# Altium schematic sheet FP_connectors.SchDoc: =ProjectName
size 420 x 297 mm; Author: SBH; CompanyName: WUT; DrawnBy: SBH; Organization: ISE-WUT; Address1: Warsaw Univeristy of Technology; Address2: Nowowiejska 15/19; Revision: -; SheetNumber: -; SheetTotal: -; EDA_Number: ARTIQ; Projet: ADC/DAC MEZZANINE; ModifiedBy: -; CreateDate: XX/XX/XXXX; CheckedDate: -; Title2: FP_connectors.SchDoc; DivGrp: ISE; Designer: SBH; ModifiedDate: -; ProjectName: ADC/DAC MEZZANINE
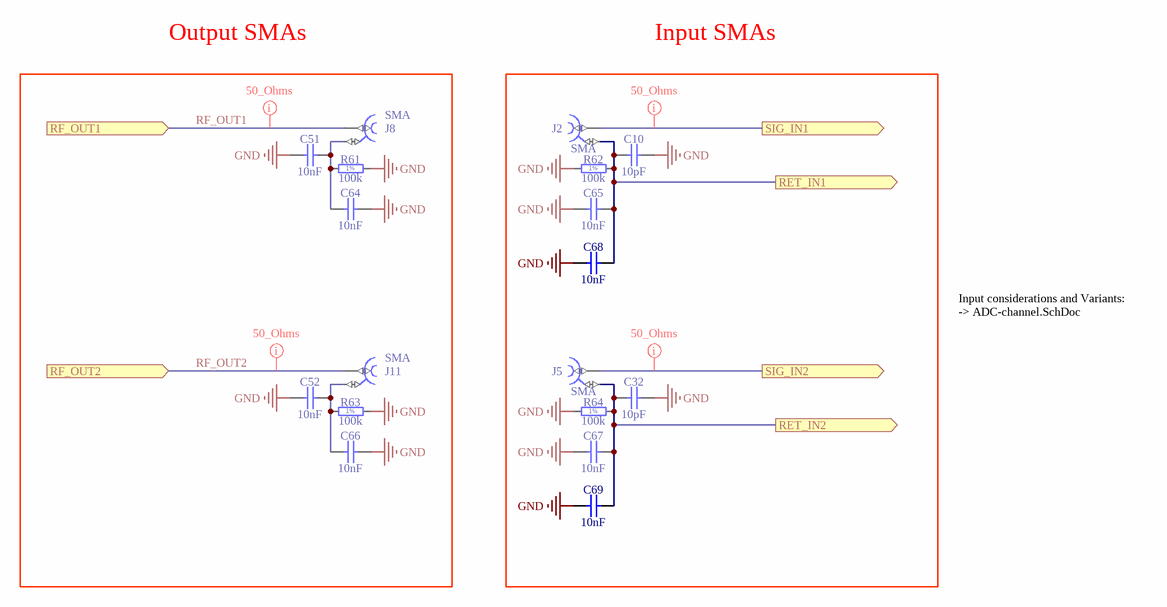
[diagram p0: FP_connectors.SchDoc]

## Parts
C10  10pF  [CAPC1005X55N]
C32  10pF  [CAPC1005X55N]
C51  10nF  [CAPC1005X55N]
C52  10nF  [CAPC1005X55N]
C64  10nF  [CAPC1005X55N]
C65  10nF  [CAPC1005X55N]
C66  10nF  [CAPC1005X55N]
C67  10nF  [CAPC1005X55N]
C68  10nF  [CAPC1005X55N]
C69  10nF  [CAPC1005X55N]
J2  SMA  [Telegartner_J01151A0921]
J5  SMA  [Telegartner_J01151A0921]
J8  SMA  [TELEGARTNER_J01151A0451]
J11  SMA  [TELEGARTNER_J01151A0451]
R61  100k  [RESC1005X40N]
R62  100k  [RESC1005X40N]
R63  100k  [RESC1005X40N]
R64  100k  [RESC1005X40N]

## Ports
RET_IN1 (out), RET_IN2 (out), RF_OUT1 (in), RF_OUT2 (in), SIG_IN1 (out), SIG_IN2 (out)

## Nets
GND: C10.2 C32.2 C51.1 C52.1 C64.2 C65.1 C66.2 C67.1 C68.1 C69.1 R61.1 R62.1 R63.1 R64.1
RET_IN1: C10.1 C65.2 C68.2 J2.2 R62.2 ; port RET_IN1
RET_IN2: C32.1 C67.2 C69.2 J5.2 R64.2 ; port RET_IN2
RF_OUT1: J8.1 ; port RF_OUT1
RF_OUT2: J11.1 ; port RF_OUT2
SIG_IN1: J2.1 ; port SIG_IN1
SIG_IN2: J5.1 ; port SIG_IN2
NetC51_2: C51.2 C64.1 J8.2 R61.2
NetC52_2: C52.2 C66.1 J11.2 R63.2

## Layout directives
net class 50_Ohms: RF_OUT1, RF_OUT2, SIG_IN1, SIG_IN2

## Notes on the sheet
- Output SMAs
- Input SMAs
- Input considerations and Variants:
  -> ADC-channel.SchDoc
- Project/Equipment
- Document
- Designer
- Drawn by
- Check.by
- File
- Last Mod.
- Print Date
- Sheet
- Size
- A3
- of
- Rev
- (in symbol R0402_100K_1%_0.0625W_100PPM) 1%

## Library data of the parts
C10 C32 = CC0402_10PF_50V_5%_C0G: Non-polarised capacitor; Part Description: SMD Multilayer Chip Ceramic Capacitor; Manufacturer: GENERIC; Manufacturer1 Part Number: C0402C100J5GACTU; Voltage: 50V; TC: C0G/NP0; Tolerance: ±5%; Part Number: CC0402_10PF_50V_5%_C0G; Component Kind: Standard; Component Type: Standard; Pin Count: 2; Value: 10pF; Status: Preferred; Manufacturer Part Number: CC0402_10PF_50V_5%_C0G; Case: 0402; Mounted: Yes; Socket: No; SMD: Yes; Sense: No; Manufacturer1 Example: KEMET; Manufacturer1 ComponentHeight: 0.55mm; HelpURL: \\cern.ch\dfs\Applications\Altium\Datasheets\CC0805_C0G_KEMET_(Commercial Grade).pdf; Author: CERN DEM JLC; CreateDate: 2007-12-03; LatestRevisionDate: 2015-04-22
C51 C52 C64-C69 = CC0402_10NF_16V_10%_X7R: Non-polarised capacitor; Part Description: SMD Multilayer Chip Ceramic Capacitor; Manufacturer: GENERIC; Manufacturer1 Part Number: 223878715636; Voltage: 16V; TC: X7R; Tolerance: ±10%; Part Number: CC0402_10NF_16V_10%_X7R; Component Kind: Standard; Component Type: Standard; Pin Count: 2; Value: 10nF; Status: Not Recommended; Manufacturer Part Number: CC0402_10NF_16V_10%_X7R; Case: 0402; Mounted: Yes; Socket: No; SMD: Yes; Sense: No; Manufacturer1 Example: PHYCOMP; Manufacturer1 ComponentHeight: 0.55mm; HelpURL: \\cern.ch\dfs\Applications\Altium\Datasheets\CC0402_X7R_PHYCOMP.pdf; Author: CERN DEM JLC; CreateDate: 2007-12-03; LatestRevisionDate: 2007-12-03
J2 J5 = SMA_RA_J01151A0921: RiSMA 50 Ohms Right Angle PCB Jack; Manufacturer: Telegartner; PressFit: No; Part Number: Telegartner_J01151A0921; Component Kind: Standard; Component Type: Standard; Pin Count: 2; Family: SMA; Mounted: Yes; Socket: No; SMD: No; Sense: No; Status: None; Part Description: SMA 50 Ohms Right Angle PCB Jack; Manufacturer Part Number: J01151A0921; ComponentHeight: 9.6mm; HelpURL: \\cern.ch\dfs\Applications\Altium\Datasheets\HUBER-SUHNER_85_SMA-50-0-101-111_NE.pdf; Author: GK; CreateDate: 11.11.2016; LatestRevisionDate: 11.11.2016
J8 J11 = TELEGARTNER_J01151A0451: Part Description: SMA 50 ohms Edge Mount Bulkhead Jack Receptacle; PressFit: No; Part Number: TELEGARTNER_J01151A0451; Component Kind: Standard; Component Type: Standard; Pin Count: 2; Family: SMA; Mounted: Yes; Socket: No; SMD: No; Sense: No; Status: None; Manufacturer: TELEGARTNER; Manufacturer Part Number: J01151A0451; ComponentHeight: 7mm; HelpURL: \\cern.ch\dfs\Applications\Altium\Datasheets\TELEGARTNER_J01151A0451.pdf; Author: CERN DEM JLC; CreateDate: 27.10.2016; LatestRevisionDate: 27.10.2016
R61-R64 = R0402_100K_1%_0.0625W_100PPM: Resistor - 1%; Part Description: General Purpose Thick Film Chip Resistor; Manufacturer: GENERIC; Manufacturer1 Part Number: 232270671004L; TC: ±100ppm/°C; Part Number: R0402_100K_1%_0.0625W_100PPM; Component Kind: Standard; Component Type: Standard; Pin Count: 2; Value: 100k; Status: Not recommended; Power: 0.0625W; Tolerance: ±1%; Manufacturer Part Number: R0402_100K_1%_0.0625W_100PPM; Case: 0402; Mounted: Yes; Sense: No; Socket: No; SMD: Yes; Manufacturer1 Example: YAGEO PHYCOMP; Manufacturer1 ComponentHeight: 0.4mm; HelpURL: \\cern.ch\dfs\Applications\Altium\Datasheets\R0402_Phycomp_RC0402.pdf; Author: CERN DEM JLC; CreateDate: 2007-12-03; LatestRevisionDate: 2012-10-17